# Altium schematic sheet PWR.SchDoc
size A4; DocumentNumber: 2; SheetNumber: 2; SheetTotal: 2
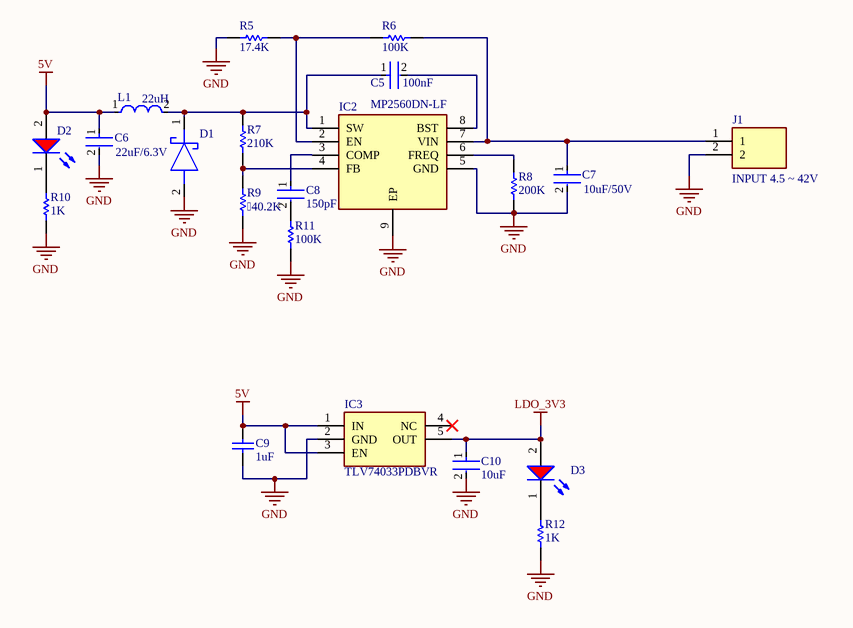
[diagram p0: PWR.SchDoc]

## Parts
C5  100nF  [FP-CC0805-0_85-MFG]
C6  22uF/6.3V  [FP-GRM21B-0_15-MFG]
C7  10uF/50V  [FP-GRM31-0_2-IPC_A]
C8  150pF  [FP-0805-L_2_01_0_2-W_1_25-IPC_A]
C9  1uF  [CAPC2013X140X50LL20T25]
C10  10uF  [FP-GRM21B-0_1-IPC_C]
D1  SBR2A40P1-7  [POWERDI123_1]  (value not drawn)
D2  RED LED  [WL-SMCW_0805_150080xx75000]  (value not drawn)
D3  RED LED  [WL-SMCW_0805_150080xx75000]  (value not drawn)
IC2  MP2560DN-LF  [SOIC127P600X170-9N]
IC3  TLV74033PDBVR  [SOT95P280X145-5N]
J1  INPUT 4.5 ~ 42V  [1715022]
L1  22uH  [FP-SRP6060FA-MFG]
R5  17.4K  [RESC2013X50X30NL20T20]
R6  100K  [RESC2013X70X40ML20T20]
R7  210K  [RESC2013X50X30LL20T20]
R8  200K  [RESC2013X50X30NL20T20]
R9  40.2K  [RESC2013X50X30NL20T20]
R10  1K  [RESC2013X50X30NL20T20]
R11  100K  [RESC2013X70X40ML20T20]
R12  1K  [RESC2013X50X30NL20T20]

## Nets
5V: C6.1 C9.2 D2.2(A) IC3.1(IN) IC3.3(EN) L1.1
GND: C6.2 C7.2 C9.1 C10.2 D1.2(A) IC2.5(GND) IC2.9(EP) IC3.2(GND) J1.2 R5.1 R8.1 R9.1 R10.1 R11.1 R12.1
LDO_3V3: C10.1 D3.2(A) IC3.5(OUT)
NetC5_1: C5.1 D1.1(K) IC2.1(SW) L1.2 R7.2
NetC5_2: C5.2 IC2.8(BST)
NetC7_1: C7.1 IC2.7(VIN) J1.1 R6.2
NetC8_1: C8.1 IC2.3(COMP)
NetC8_2: C8.2 R11.2
NetD2_1: D2.1(K) R10.2
NetD3_1: D3.1(K) R12.2
NetIC2_2: IC2.2(EN) R5.2 R6.1
NetIC2_4: IC2.4(FB) R7.1 R9.2
NetIC2_6: IC2.6(FREQ) R8.2

Not connected (* = marked no-connect by the designer): IC3 4(NC)*

## Library data of the parts
C5 = CMP-1036-04402-6: CAP CER 0.1UF 16V X7R 0805; Manufacturer Part Number: CC0805KRX7R7BB104; Manufacturer: Yageo; Material: Ceramic; Tolerance: 0.1; Temperature: -30°C to +85°C; Lead Free: Yes; Footprint Url: http://www.yageo.com/exep/pages/download/literatures/UPY-C_GEN_24.pdf; Voltage Rating: 16 V; Package: CC0805-0.85; RoHS: TRUE; Digikey Description: CAP CER 0.1UF 16V X7R 0805; Category: Cap; Octopart: https://octopart.com/cc0805krx7r7bb104-yageo-39467769; Capacitance: 100 nF; Device Class L3: Ceramic Capacitors; ComponentLink2URL: http://www.yageo.com/documents/recent/UPY-GPHC_Y5V_6.3V-to-50V_8.pdf; Value: 100 nF; Temperature Range Low: -30°C; Mouser Description: Multilayer Ceramic Capacitors MLCC - SMD/SMT 100nF 16V X7R 10%; Automotive: No; Device Class L2: Capacitors; Height: 0.95mm; ComponentLink2Description: Datasheet; Temperature Characteristic: X7R; Ipc Land Pattern Name: CAPC200125X85; Device Class L1: Passive Components; Temperature Range High: +85°C
C6 = CMP-2007-03385-2: Chip Multilayer Ceramic Capacitors for General Purpose, 0805, 22uF, X5R, 15%, 20%, 6.3V; Material: Ceramic; Max Operating Temperature: 85°C; Voltage: 6.3V; Min Operating Temperature: -55°C; Case/Package: 0805; Thickness: 0.053inch; Dielectric: X5R; Packaging: Tape and Reel; Depth: 1.25mm; Termination: SMD/SMT; Voltage Rating (DC): 6.3V; Radiation Hardening: No; Tolerance: 20%; Mount: Surface Mount; Lead Free: Lead Free; Package Quantity: 1; REACH SVHC: No SVHC; Voltage Rating: 6.3V; Capacitance: 22uF; Length: 2mm; Case Code (Imperial): 0805; Case Code (Metric): 2012; Width: 0.049inch; Height: 1.25mm
C7 = CMP-2000-05256-2: CAP CER 10UF 50V X5R 1206; Manufacturer: Murata Electronics North America; Manufacturer Part Number: GRM31CR61H106KA12L; Tolerance: 10%; Temperature Coefficient: 15%; Material: Ceramic; Height: 1.8mm; Temperature: -55°C to +85°C; Lead Free: Yes; Temperature Characteristic: X5R; ComponentLink2Description: Datasheet; Digikey Description: CAP CER 10UF 50V X5R 1206; Octopart: https://octopart.com/grm31cr61h106ka12l-murata-18903335; Device Class L2: Capacitors; Automotive: No; Value: 10uF; Temperature Range High: +85°C; Temperature Range Low: -55°C; Device Class L3: Ceramic Capacitors; Voltage Rating: 50V; Capacitance: 10uF; Device Class L1: Passive Components; Mouser Description: Multilayer Ceramic Capacitors MLCC - SMD/SMT 1206 10uF 50volt X5R +/-10%; ComponentLink2URL: https://search.murata.co.jp/Ceramy/image/img/A01X/G101/ENG/GRM31CR61H106KA12-01A.pdf; Package: GRM31-0.2; RoHS: TRUE; Category: Cap
C8 = CMP-2007-04281-2: General Purpose Ceramic Capacitor, 0805, 150pF, 5%, C0G, 30ppm/°C, 50V; Lead Free: Lead Free; Tolerance: 5%; Dielectric: C0G; Packaging: Tape and Reel; RoHS Compliant: Yes; Depth: 1.25mm; Construction: Flat; Capacitance: 150pF; Max Operating Temperature: 125°C; Number of Pins: 2; Radiation Hardening: No; REACH SVHC: No SVHC; Case Code (Imperial): 0805; Series: -; Termination: SMD/SMT; Voltage: 50V; Thickness: 0.037inch; Case Code (Metric): 2012; Min Operating Temperature: -55°C; Voltage Rating (DC): 50V; Mount: Surface Mount; Length: 2.01mm; Width: 0.049inch; Package Quantity: 1; Voltage Rating: 50V; Case/Package: 0805; Contact Plating: Tin
C9 = CMP-2007-03234-1: Part Number: C0805C105K3RACTU; Manufacturer: Kemet
C10 = CMP-2007-03453-2: Chip Multilayer Ceramic Capacitors for General Purpose, 0805, 10uF, X5R, 15%, 10%, 16V; Radiation Hardening: No; Thickness: 0.053inch; Voltage Rating (DC): 16V; Lead Free: Lead Free; Package Quantity: 1; Width: 1.25mm; Case Code (Imperial): 0805; Depth: 1.25mm; Packaging: Tape and Reel; Dielectric: X5R; Max Operating Temperature: 85°C; Tolerance: 10%; Voltage Rating: 16V; Voltage: 16V; Capacitance: 10uF; Height: 1.25mm; Case Code (Metric): 2012; Material: Ceramic; Mount: Surface Mount; Case/Package: 0805; REACH SVHC: No SVHC; Length: 2mm; Min Operating Temperature: -55°C; Termination: SMD/SMT
D1 = SBR2A40P1-7: Schottky Diode; Manufacturer_Name: Diodes Incorporated; Datasheet Link: https://www.diodes.com/assets/Datasheets/SBR2A40P1.pdf; Manufacturer_Part_Number: SBR2A40P1-7; Mouser Part Number: 621-SBR2A40P1-7; Mouser Price/Stock: https://www.mouser.co.uk/ProductDetail/Diodes-Incorporated/SBR2A40P1-7?qs=KhBT%2FQof6UyH2neobXoDyQ%3D%3D; Arrow Part Number: SBR2A40P1-7; Arrow Price/Stock: https://www.arrow.com/en/products/sbr2a40p1-7/diodes-incorporated?region=nac
D2 D3 = CMP-1426-00011-2: SMD LED 0805 /; NexarPartId: 29717781; Peak Wavelength: 630nm; Wavelength: 625nm; Viewing Angle: 140°; Test Current: 20mA; Forward Voltage: 2V; Forward Current: 100mA; Lens Style: Clear, Rectangular; Luminous Intensity: 150mcd; Max Reverse Voltage (DC): 5V; Length: 2mm; Case Code (Imperial): 0805; RoHS: Compliant; Max Operating Temperature: 85°C; Height: 700µm; Packaging: Tape and Reel; Color: Red; Case/Package: 0805; REACH SVHC: Unknown; Dominant Wavelength: 625nm; Min Operating Temperature: -40°C; Case Code (Metric): 2012; Mount: Surface Mount; Width: 1.25mm
IC2 = MP2560DN-LF: Integrated Circuit; Manufacturer_Name: Monolithic Power Systems (MPS); Datasheet Link: http://www.monolithicpower.com/DesktopModules/DocumentManage/API/Document/getDocument?id=1798; Height: 1.7mm; Manufacturer_Part_Number: MP2560DN-LF; Mouser Part Number: 946-MP2560DNLF; Mouser Price/Stock: https://www.mouser.co.uk/ProductDetail/Monolithic-Power-Systems-MPS/MP2560DN-LF?qs=rC7bBWoQAAleyiym%2FnQvhQ%3D%3D
IC3 = TLV74033PDBVR: Integrated Circuit; Manufacturer_Name: Texas Instruments; Datasheet Link: https://www.ti.com/lit/ds/symlink/tlv740p.pdf?ts=1599647884466&ref_url=https%253A%252F%252Fwww.ti.com%252Fpower-management%252Flinear-regulators-ldo%252Fproducts.html; Height: 1.45mm; Manufacturer_Part_Number: TLV74033PDBVR; Mouser Part Number: 595-TLV74033PDBVR; Mouser Price/Stock: https://www.mouser.co.uk/ProductDetail/Texas-Instruments/TLV74033PDBVR?qs=sPbYRqrBIVkaG2WMvPh1eg%3D%3D; Arrow Part Number: TLV74033PDBVR; Arrow Price/Stock: null?region=nac
J1 = 1715022: Connector; Manufacturer_Name: Phoenix Contact; Datasheet Link: http://www.phoenixcontact.com/de/produkte/1715022/pdf; Height: 13.85mm; Manufacturer_Part_Number: 1715022; Mouser Part Number: 651-1715022; Mouser Price/Stock: https://www.mouser.co.uk/ProductDetail/Phoenix-Contact/1715022?qs=A%2FKWGUWTCZi6QclA%252B6CJ3A%3D%3D; Arrow Part Number: 1715022; Arrow Price/Stock: null?region=nac
L1 = CMP-07248-000025-2: IND,6.6X6.4X5.8MM,22UH,20%,5A,SH; Self Resonant Frequency: 10MHz; Shielding: Shielded; Test Frequency: 100kHz; DC Resistance (DCR): 60.5mR; Core Material: Ferrite; Saturation Current: 5.6A; Current Rating: 5A; Composition: Wirewound; Inductance: 22uH; Min Operating Temperature: -55°C; Tolerance: 20%; Packaging: Tape and Reel; Ratings: AEC-Q200; Case/Package: Nonstandard; Mount: Surface Mount; Max Operating Temperature: 155°C
R5 = CMP-2001-04989-1: Manufacturer: Vishay Dale; Part Number: CRCW080517K4FKEA
R6 R11 = CMP-2001-04377-1: Part Number: ERJ-6ENF1003V; Manufacturer: Panasonic
R7 = CMP-1013-00770-2: Part Number: CRCW0805210KFKEA; Manufacturer: Vishay Dale
R8 = CMP-2001-03660-1: Part Number: CRCW0805200KFKEA; Manufacturer: Vishay Dale
R9 = CMP-2001-03903-1: Part Number: CRCW080540K2FKEA; Manufacturer: Vishay Dale
R10 R12 = CMP-1013-00510-2: Part Number: CRCW08051K00FKEA; Manufacturer: Vishay Dale